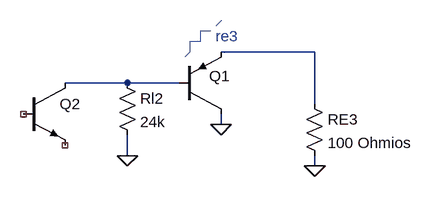
[diagram p0: schematic impedancia_salida.asc]
impedancia_salida.asc, the LTspice schematic file:
Version 4
SHEET 1 880 680
WIRE 336 112 192 112
WIRE 48 160 -48 160
WIRE 128 160 48 160
WIRE 336 192 336 112
WIRE 192 224 192 208
WIRE 48 272 48 240
WIRE 336 288 336 272
FLAG 48 272 0
FLAG 192 224 0
FLAG 336 288 0
SYMBOL pnp 128 208 M180
WINDOW 0 46 59 Left 2
SYMATTR InstName Q1
SYMATTR Value ""
SYMBOL npn -112 160 R0
SYMATTR InstName Q2
SYMATTR Value ""
SYMBOL res 32 144 R0
SYMATTR InstName Rl2
SYMATTR Value 24k
SYMBOL res 320 176 R0
SYMATTR InstName RE3
SYMATTR Value 100 Ohmios
TEXT 184 88 Left 2 ;re3
LINE Normal 144 112 128 128 2
LINE Normal 144 96 144 112 2
LINE Normal 160 96 144 96 2
LINE Normal 160 80 160 96 2
LINE Normal 176 80 160 80 2
LINE Normal 192 64 176 80 2

The netlist it stands for:
* impedancia_salida.asc
Q1 0 N002 N001 0
Q2 N002 NC_01 NC_02 0
Rl2 N002 0 24k
RE3 N001 0 100 Ohmios
.model NPN NPN
.model PNP PNP
.lib standard.bjt
* re3
.backanno
.end